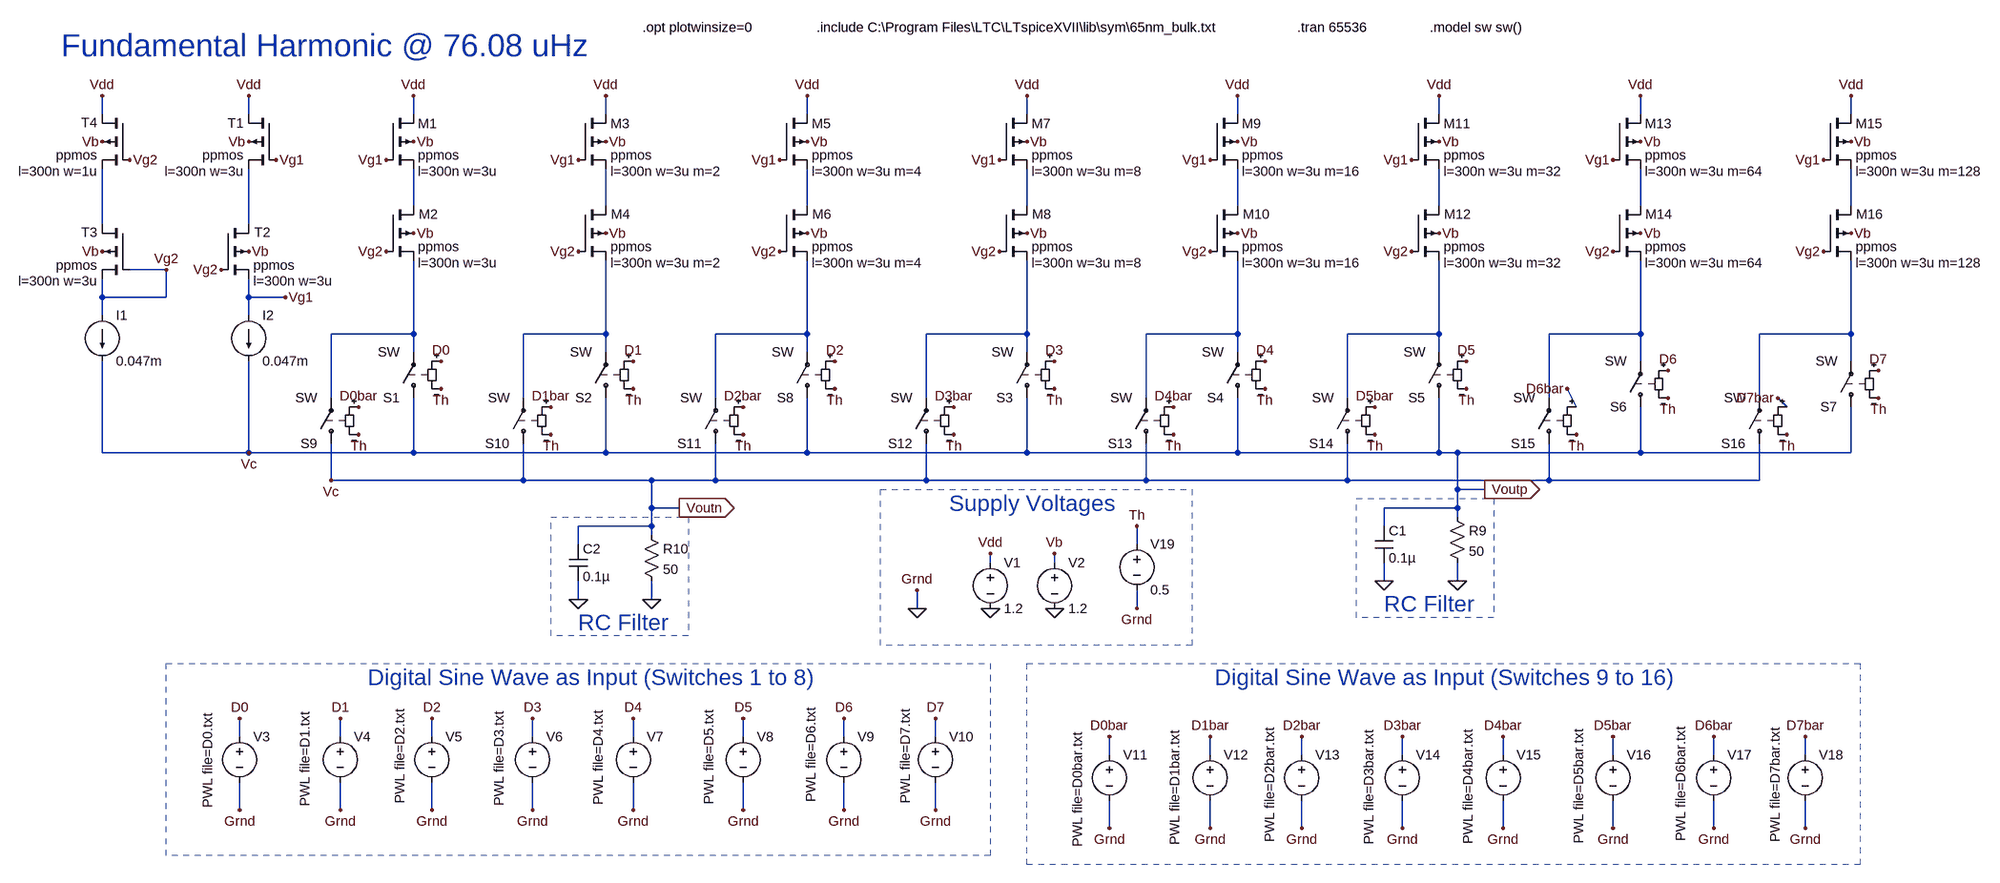
[diagram p0: schematic Sine Wave With Diff DAC.asc]
Sine Wave With Diff DAC.asc, the LTspice schematic file:
Version 4
SHEET 1 1928 980
WIRE -1504 -640 -1504 -672
WIRE -1248 -640 -1248 -672
WIRE -960 -640 -960 -672
WIRE -624 -640 -624 -672
WIRE -272 -640 -272 -672
WIRE 112 -640 112 -672
WIRE 480 -640 480 -672
WIRE 832 -640 832 -672
WIRE 1184 -640 1184 -672
WIRE 1552 -640 1552 -672
WIRE -960 -480 -960 -544
WIRE -624 -480 -624 -544
WIRE -272 -480 -272 -544
WIRE 112 -480 112 -544
WIRE 480 -480 480 -544
WIRE 832 -480 832 -544
WIRE 1184 -480 1184 -544
WIRE 1552 -480 1552 -544
WIRE -1504 -448 -1504 -544
WIRE -1248 -448 -1248 -544
WIRE -1392 -368 -1456 -368
WIRE -1504 -320 -1504 -352
WIRE -1392 -320 -1392 -368
WIRE -1392 -320 -1504 -320
WIRE -1248 -320 -1248 -352
WIRE -1184 -320 -1248 -320
WIRE -1504 -288 -1504 -320
WIRE -1248 -288 -1248 -320
WIRE -960 -256 -960 -384
WIRE -960 -256 -1104 -256
WIRE -624 -256 -624 -384
WIRE -624 -256 -768 -256
WIRE -272 -256 -272 -384
WIRE -272 -256 -432 -256
WIRE 112 -256 112 -384
WIRE 112 -256 -64 -256
WIRE 480 -256 480 -384
WIRE 480 -256 320 -256
WIRE 832 -256 832 -384
WIRE 832 -256 672 -256
WIRE 1184 -256 1184 -384
WIRE 1184 -256 1024 -256
WIRE 1552 -256 1552 -384
WIRE 1552 -256 1392 -256
WIRE -960 -224 -960 -256
WIRE -624 -224 -624 -256
WIRE -272 -224 -272 -256
WIRE 112 -224 112 -256
WIRE 480 -224 480 -256
WIRE 832 -224 832 -256
WIRE 1184 -208 1184 -256
WIRE 1552 -208 1552 -256
WIRE -1104 -144 -1104 -256
WIRE -768 -144 -768 -256
WIRE -432 -144 -432 -256
WIRE -64 -144 -64 -256
WIRE 320 -144 320 -256
WIRE 672 -144 672 -256
WIRE 1024 -144 1024 -256
WIRE 1392 -144 1392 -256
WIRE 1072 -128 1056 -160
WIRE 1440 -128 1424 -144
WIRE -1504 -48 -1504 -208
WIRE -1248 -48 -1248 -208
WIRE -1248 -48 -1504 -48
WIRE -960 -48 -960 -144
WIRE -960 -48 -1248 -48
WIRE -624 -48 -624 -144
WIRE -624 -48 -960 -48
WIRE -272 -48 -272 -144
WIRE -272 -48 -624 -48
WIRE 112 -48 112 -144
WIRE 112 -48 -272 -48
WIRE 480 -48 480 -144
WIRE 480 -48 112 -48
WIRE 832 -48 832 -144
WIRE 832 -48 480 -48
WIRE 864 -48 832 -48
WIRE 1184 -48 1184 -128
WIRE 1184 -48 864 -48
WIRE 1552 -48 1552 -128
WIRE 1552 -48 1184 -48
WIRE -1104 0 -1104 -64
WIRE -768 0 -768 -64
WIRE -768 0 -1104 0
WIRE -544 0 -768 0
WIRE -432 0 -432 -64
WIRE -432 0 -544 0
WIRE -64 0 -64 -64
WIRE -64 0 -432 0
WIRE 320 0 320 -64
WIRE 320 0 -64 0
WIRE 672 0 672 -64
WIRE 672 0 320 0
WIRE 1024 0 1024 -64
WIRE 1024 0 672 0
WIRE 1392 0 1392 -64
WIRE 1392 0 1024 0
WIRE 864 16 864 -48
WIRE 912 16 864 16
WIRE -544 48 -544 0
WIRE -496 48 -544 48
WIRE 864 48 864 16
WIRE 864 48 736 48
WIRE 864 64 864 48
WIRE -544 80 -544 48
WIRE -544 80 -672 80
WIRE 736 80 736 48
WIRE -544 96 -544 80
WIRE -672 112 -672 80
WIRE 304 112 304 80
WIRE 48 144 48 128
WIRE 160 144 160 128
WIRE 736 176 736 144
WIRE 864 176 864 144
WIRE -672 208 -672 176
WIRE -544 208 -544 176
WIRE -80 224 -80 192
WIRE 304 224 304 192
WIRE -1264 448 -1264 416
WIRE -1088 448 -1088 416
WIRE -928 448 -928 416
WIRE -752 448 -752 416
WIRE -576 448 -576 416
WIRE -384 448 -384 416
WIRE -208 448 -208 416
WIRE -48 448 -48 416
WIRE 256 480 256 448
WIRE 432 480 432 448
WIRE 592 480 592 448
WIRE 768 480 768 448
WIRE 944 480 944 448
WIRE 1136 480 1136 448
WIRE 1312 480 1312 448
WIRE 1472 480 1472 448
WIRE -1264 576 -1264 528
WIRE -1088 576 -1088 528
WIRE -928 576 -928 528
WIRE -752 576 -752 528
WIRE -576 576 -576 528
WIRE -384 576 -384 528
WIRE -208 576 -208 528
WIRE -48 576 -48 528
WIRE 256 608 256 560
WIRE 432 608 432 560
WIRE 592 608 592 560
WIRE 768 608 768 560
WIRE 944 608 944 560
WIRE 1136 608 1136 560
WIRE 1312 608 1312 560
WIRE 1472 608 1472 560
FLAG -1504 -400 Vb
FLAG -1248 -400 Vb
FLAG -1504 -592 Vb
FLAG -1248 -592 Vb
FLAG -1248 -672 Vdd
FLAG -1504 -672 Vdd
FLAG -1456 -560 Vg2
FLAG -1392 -368 Vg2
FLAG -1200 -560 Vg1
FLAG -1184 -320 Vg1
FLAG -960 -432 Vb
FLAG -960 -592 Vb
FLAG -960 -672 Vdd
FLAG -1008 -560 Vg1
FLAG -1008 -400 Vg2
FLAG -1296 -368 Vg2
FLAG -624 -432 Vb
FLAG -624 -592 Vb
FLAG -624 -672 Vdd
FLAG -672 -560 Vg1
FLAG -672 -400 Vg2
FLAG -272 -432 Vb
FLAG -272 -592 Vb
FLAG -272 -672 Vdd
FLAG -320 -560 Vg1
FLAG -320 -400 Vg2
FLAG 112 -432 Vb
FLAG 112 -592 Vb
FLAG 112 -672 Vdd
FLAG 64 -560 Vg1
FLAG 64 -400 Vg2
FLAG 480 -432 Vb
FLAG 480 -592 Vb
FLAG 480 -672 Vdd
FLAG 432 -560 Vg1
FLAG 432 -400 Vg2
FLAG 832 -432 Vb
FLAG 832 -592 Vb
FLAG 832 -672 Vdd
FLAG 784 -560 Vg1
FLAG 784 -400 Vg2
FLAG 1184 -432 Vb
FLAG 1184 -592 Vb
FLAG 1184 -672 Vdd
FLAG 1136 -560 Vg1
FLAG 1136 -400 Vg2
FLAG 1552 -432 Vb
FLAG 1552 -592 Vb
FLAG 1552 -672 Vdd
FLAG 1504 -560 Vg1
FLAG 1504 -400 Vg2
FLAG 160 128 Vb
FLAG 48 128 Vdd
FLAG -912 -160 Th
FLAG -576 -160 Th
FLAG -224 -160 Th
FLAG 160 -160 Th
FLAG 528 -160 Th
FLAG 880 -160 Th
FLAG 1232 -144 Th
FLAG 1600 -144 Th
FLAG -912 -208 D0
FLAG -576 -208 D1
FLAG -224 -208 D2
FLAG 160 -208 D3
FLAG 528 -208 D4
FLAG 880 -208 D5
FLAG 1232 -192 D6
FLAG 1600 -192 D7
FLAG 912 16 Voutp
IOPIN 912 16 Out
FLAG 864 176 0
FLAG 48 224 0
FLAG 160 224 0
FLAG -80 224 0
FLAG -80 192 Grnd
FLAG 736 176 0
FLAG -1248 -48 Vc
FLAG -496 48 Voutn
IOPIN -496 48 Out
FLAG -544 208 0
FLAG -672 208 0
FLAG -1056 -80 Th
FLAG -720 -80 Th
FLAG -384 -80 Th
FLAG -16 -80 Th
FLAG 368 -80 Th
FLAG 720 -80 Th
FLAG 1072 -80 Th
FLAG 1440 -80 Th
FLAG -1056 -128 D0bar
FLAG -720 -128 D1bar
FLAG -384 -128 D2bar
FLAG -16 -128 D3bar
FLAG 368 -128 D4bar
FLAG 720 -128 D5bar
FLAG 1056 -160 D6bar
FLAG 1424 -144 D7bar
FLAG -1104 0 Vc
FLAG -1088 576 Grnd
FLAG -928 576 Grnd
FLAG -752 576 Grnd
FLAG -576 576 Grnd
FLAG -384 576 Grnd
FLAG -208 576 Grnd
FLAG -48 576 Grnd
FLAG -1264 576 Grnd
FLAG -1264 416 D0
FLAG -1088 416 D1
FLAG -928 416 D2
FLAG -752 416 D3
FLAG -576 416 D4
FLAG -384 416 D5
FLAG -208 416 D6
FLAG -48 416 D7
FLAG 432 608 Grnd
FLAG 592 608 Grnd
FLAG 768 608 Grnd
FLAG 944 608 Grnd
FLAG 1136 608 Grnd
FLAG 1312 608 Grnd
FLAG 1472 608 Grnd
FLAG 256 608 Grnd
FLAG 256 448 D0bar
FLAG 432 448 D1bar
FLAG 592 448 D2bar
FLAG 768 448 D3bar
FLAG 944 448 D4bar
FLAG 1136 448 D5bar
FLAG 1312 448 D6bar
FLAG 1472 448 D7bar
FLAG 304 224 Grnd
FLAG 304 80 Th
SYMBOL pmos4 -1200 -640 M0
WINDOW 0 56 16 Left 2
WINDOW 123 56 100 Left 2
SYMATTR InstName T1
SYMATTR Value2 l=300n w=3u
SYMATTR Value ppmos
SYMBOL pmos4 -1296 -448 R0
WINDOW 0 58 15 Left 2
WINDOW 123 56 100 Left 2
SYMATTR InstName T2
SYMATTR Value2 l=300n w=3u
SYMATTR Value ppmos
SYMBOL pmos4 -1456 -448 M0
WINDOW 0 56 15 Left 2
WINDOW 123 56 100 Left 2
SYMATTR InstName T3
SYMATTR Value2 l=300n w=3u
SYMATTR Value ppmos
SYMBOL current -1504 -288 R0
WINDOW 123 0 0 Left 0
WINDOW 39 0 0 Left 0
SYMATTR InstName I1
SYMATTR Value 0.047m
SYMBOL current -1248 -288 R0
WINDOW 123 0 0 Left 0
WINDOW 39 0 0 Left 0
SYMATTR InstName I2
SYMATTR Value 0.047m
SYMBOL pmos4 -1456 -640 M0
WINDOW 0 56 15 Left 2
WINDOW 123 56 100 Left 2
SYMATTR InstName T4
SYMATTR Value2 l=300n w=1u
SYMATTR Value ppmos
SYMBOL pmos4 -1008 -640 R0
WINDOW 0 56 17 Left 2
WINDOW 123 56 100 Left 2
SYMATTR InstName M1
SYMATTR Value2 l=300n w=3u
SYMATTR Value ppmos
SYMBOL pmos4 -1008 -480 R0
WINDOW 0 57 15 Left 2
WINDOW 123 56 100 Left 2
SYMATTR InstName M2
SYMATTR Value2 l=300n w=3u
SYMATTR Value ppmos
SYMBOL pmos4 -672 -640 R0
WINDOW 0 56 17 Left 2
WINDOW 123 56 100 Left 2
SYMATTR InstName M3
SYMATTR Value2 l=300n w=3u m=2
SYMATTR Value ppmos
SYMBOL pmos4 -672 -480 R0
WINDOW 0 57 15 Left 2
WINDOW 123 56 100 Left 2
SYMATTR InstName M4
SYMATTR Value2 l=300n w=3u m=2
SYMATTR Value ppmos
SYMBOL pmos4 -320 -640 R0
WINDOW 0 56 17 Left 2
WINDOW 123 56 100 Left 2
SYMATTR InstName M5
SYMATTR Value2 l=300n w=3u m=4
SYMATTR Value ppmos
SYMBOL pmos4 -320 -480 R0
WINDOW 0 57 15 Left 2
WINDOW 123 56 100 Left 2
SYMATTR InstName M6
SYMATTR Value2 l=300n w=3u m=4
SYMATTR Value ppmos
SYMBOL pmos4 64 -640 R0
WINDOW 0 56 17 Left 2
WINDOW 123 56 100 Left 2
SYMATTR InstName M7
SYMATTR Value2 l=300n w=3u m=8
SYMATTR Value ppmos
SYMBOL pmos4 64 -480 R0
WINDOW 0 57 15 Left 2
WINDOW 123 56 100 Left 2
SYMATTR InstName M8
SYMATTR Value2 l=300n w=3u m=8
SYMATTR Value ppmos
SYMBOL pmos4 432 -640 R0
WINDOW 0 56 17 Left 2
WINDOW 123 56 100 Left 2
SYMATTR InstName M9
SYMATTR Value2 l=300n w=3u m=16
SYMATTR Value ppmos
SYMBOL pmos4 432 -480 R0
WINDOW 0 57 15 Left 2
WINDOW 123 56 100 Left 2
SYMATTR InstName M10
SYMATTR Value2 l=300n w=3u m=16
SYMATTR Value ppmos
SYMBOL pmos4 784 -640 R0
WINDOW 0 56 17 Left 2
WINDOW 123 56 100 Left 2
SYMATTR InstName M11
SYMATTR Value2 l=300n w=3u m=32
SYMATTR Value ppmos
SYMBOL pmos4 784 -480 R0
WINDOW 0 57 15 Left 2
WINDOW 123 56 100 Left 2
SYMATTR InstName M12
SYMATTR Value2 l=300n w=3u m=32
SYMATTR Value ppmos
SYMBOL pmos4 1136 -640 R0
WINDOW 0 56 17 Left 2
WINDOW 123 56 100 Left 2
SYMATTR InstName M13
SYMATTR Value2 l=300n w=3u m=64
SYMATTR Value ppmos
SYMBOL pmos4 1136 -480 R0
WINDOW 0 57 15 Left 2
WINDOW 123 56 100 Left 2
SYMATTR InstName M14
SYMATTR Value2 l=300n w=3u m=64
SYMATTR Value ppmos
SYMBOL pmos4 1504 -640 R0
WINDOW 0 56 17 Left 2
WINDOW 123 56 100 Left 2
SYMATTR InstName M15
SYMATTR Value2 l=300n w=3u m=128
SYMATTR Value ppmos
SYMBOL pmos4 1504 -480 R0
WINDOW 0 57 15 Left 2
WINDOW 123 56 100 Left 2
SYMATTR InstName M16
SYMATTR Value2 l=300n w=3u m=128
SYMATTR Value ppmos
SYMBOL voltage 48 128 R0
WINDOW 123 0 0 Left 0
WINDOW 39 0 0 Left 0
SYMATTR InstName V1
SYMATTR Value 1.2
SYMBOL voltage 160 128 R0
WINDOW 123 0 0 Left 0
WINDOW 39 0 0 Left 0
SYMATTR InstName V2
SYMATTR Value 1.2
SYMBOL sw -960 -128 R180
SYMATTR InstName S1
SYMBOL sw -624 -128 R180
SYMATTR InstName S2
SYMBOL sw 112 -128 R180
SYMATTR InstName S3
SYMBOL sw 480 -128 R180
SYMATTR InstName S4
SYMBOL sw 832 -128 R180
SYMATTR InstName S5
SYMBOL sw 1184 -112 R180
SYMATTR InstName S6
SYMBOL sw 1552 -112 R180
SYMATTR InstName S7
SYMBOL sw -272 -128 R180
SYMATTR InstName S8
SYMBOL res 848 48 R0
SYMATTR InstName R9
SYMATTR Value 50
SYMBOL cap 720 80 R0
SYMATTR InstName C1
SYMATTR Value 0.1µ
SYMBOL sw -1104 -48 R180
SYMATTR InstName S9
SYMBOL sw -768 -48 R180
SYMATTR InstName S10
SYMBOL sw -432 -48 R180
SYMATTR InstName S11
SYMBOL sw -64 -48 R180
SYMATTR InstName S12
SYMBOL sw 320 -48 R180
SYMATTR InstName S13
SYMBOL sw 672 -48 R180
SYMATTR InstName S14
SYMBOL sw 1024 -48 R180
SYMATTR InstName S15
SYMBOL sw 1392 -48 R180
SYMATTR InstName S16
SYMBOL res -560 80 R0
SYMATTR InstName R10
SYMATTR Value 50
SYMBOL cap -688 112 R0
SYMATTR InstName C2
SYMATTR Value 0.1µ
SYMBOL voltage -1264 432 R0
WINDOW 3 -55 -25 VRight 2
WINDOW 123 0 0 Left 0
WINDOW 39 0 0 Left 0
SYMATTR Value PWL file=D0.txt
SYMATTR InstName V3
SYMBOL voltage -1088 432 R0
WINDOW 3 -61 -28 VRight 2
WINDOW 123 0 0 Left 0
WINDOW 39 0 0 Left 0
SYMATTR Value PWL file=D1.txt
SYMATTR InstName V4
SYMBOL voltage -928 432 R0
WINDOW 3 -55 -33 VRight 2
WINDOW 123 0 0 Left 0
WINDOW 39 0 0 Left 0
SYMATTR Value PWL file=D2.txt
SYMATTR InstName V5
SYMBOL voltage -752 432 R0
WINDOW 3 -58 -29 VRight 2
WINDOW 123 0 0 Left 0
WINDOW 39 0 0 Left 0
SYMATTR Value PWL file=D3.txt
SYMATTR InstName V6
SYMBOL voltage -576 432 R0
WINDOW 3 -61 -30 VRight 2
WINDOW 123 0 0 Left 0
WINDOW 39 0 0 Left 0
SYMATTR Value PWL file=D4.txt
SYMATTR InstName V7
SYMBOL voltage -384 432 R0
WINDOW 3 -59 -31 VRight 2
WINDOW 123 0 0 Left 0
WINDOW 39 0 0 Left 0
SYMATTR Value PWL file=D5.txt
SYMATTR InstName V8
SYMBOL voltage -208 432 R0
WINDOW 3 -57 -35 VRight 2
WINDOW 123 0 0 Left 0
WINDOW 39 0 0 Left 0
SYMATTR Value PWL file=D6.txt
SYMATTR InstName V9
SYMBOL voltage -48 432 R0
WINDOW 3 -52 -33 VRight 2
WINDOW 123 0 0 Left 0
WINDOW 39 0 0 Left 0
SYMATTR Value PWL file=D7.txt
SYMATTR InstName V10
SYMBOL voltage 256 464 R0
WINDOW 3 -55 -25 VRight 2
WINDOW 123 0 0 Left 0
WINDOW 39 0 0 Left 0
SYMATTR Value PWL file=D0bar.txt
SYMATTR InstName V11
SYMBOL voltage 432 464 R0
WINDOW 3 -61 -28 VRight 2
WINDOW 123 0 0 Left 0
WINDOW 39 0 0 Left 0
SYMATTR Value PWL file=D1bar.txt
SYMATTR InstName V12
SYMBOL voltage 592 464 R0
WINDOW 3 -55 -33 VRight 2
WINDOW 123 0 0 Left 0
WINDOW 39 0 0 Left 0
SYMATTR Value PWL file=D2bar.txt
SYMATTR InstName V13
SYMBOL voltage 768 464 R0
WINDOW 3 -58 -29 VRight 2
WINDOW 123 0 0 Left 0
WINDOW 39 0 0 Left 0
SYMATTR Value PWL file=D3bar.txt
SYMATTR InstName V14
SYMBOL voltage 944 464 R0
WINDOW 3 -61 -30 VRight 2
WINDOW 123 0 0 Left 0
WINDOW 39 0 0 Left 0
SYMATTR Value PWL file=D4bar.txt
SYMATTR InstName V15
SYMBOL voltage 1136 464 R0
WINDOW 3 -59 -31 VRight 2
WINDOW 123 0 0 Left 0
WINDOW 39 0 0 Left 0
SYMATTR Value PWL file=D5bar.txt
SYMATTR InstName V16
SYMBOL voltage 1312 464 R0
WINDOW 3 -57 -35 VRight 2
WINDOW 123 0 0 Left 0
WINDOW 39 0 0 Left 0
SYMATTR Value PWL file=D6bar.txt
SYMATTR InstName V17
SYMBOL voltage 1472 464 R0
WINDOW 3 -52 -33 VRight 2
WINDOW 123 0 0 Left 0
WINDOW 39 0 0 Left 0
SYMATTR Value PWL file=D7bar.txt
SYMATTR InstName V18
SYMBOL voltage 304 96 R0
WINDOW 123 0 0 Left 0
WINDOW 39 0 0 Left 0
SYMATTR InstName V19
SYMATTR Value 0.5
TEXT -256 -792 Left 2 !.include C:\\Program Files\\LTC\\LTspiceXVII\\lib\\sym\\65nm_bulk.txt
TEXT -560 -792 Left 2 !.opt plotwinsize=0
TEXT 816 -792 Left 2 !.model sw sw()
TEXT 584 -792 Left 2 !.tran 65536
TEXT 736 216 Left 4 ;RC Filter
TEXT -672 248 Left 4 ;RC Filter
TEXT -24 40 Left 4 ;Supply Voltages
TEXT -1040 344 Left 4 ;Digital Sine Wave as Input (Switches 1 to 8)
TEXT 440 344 Left 4 ;Digital Sine Wave as Input (Switches 9 to 16)
TEXT -1576 -760 Left 5 ;Fundamental Harmonic @ 76.08 uHz
RECTANGLE Normal 928 240 688 32 2
RECTANGLE Normal 400 288 -144 16 2
RECTANGLE Normal 48 656 -1392 320 2
RECTANGLE Normal 1568 672 112 320 2
RECTANGLE Normal -480 272 -720 64 2

The netlist it stands for:
* Sine Wave With Diff DAC.asc
M§T1 Vdd Vg1 N010 Vb ppmos l=300n w=3u
M§T2 N010 Vg2 Vg1 Vb ppmos l=300n w=3u
M§T3 N009 Vg2 Vg2 Vb ppmos l=300n w=3u
I1 Vg2 Voutn 0.047m
I2 Vg1 Voutn 0.047m
M§T4 Vdd Vg2 N009 Vb ppmos l=300n w=1u
M1 Vdd Vg1 N001 Vb ppmos l=300n w=3u
M2 N001 Vg2 N011 Vb ppmos l=300n w=3u
M3 Vdd Vg1 N002 Vb ppmos l=300n w=3u m=2
M4 N002 Vg2 N012 Vb ppmos l=300n w=3u m=2
M5 Vdd Vg1 N003 Vb ppmos l=300n w=3u m=4
M6 N003 Vg2 N013 Vb ppmos l=300n w=3u m=4
M7 Vdd Vg1 N004 Vb ppmos l=300n w=3u m=8
M8 N004 Vg2 N014 Vb ppmos l=300n w=3u m=8
M9 Vdd Vg1 N005 Vb ppmos l=300n w=3u m=16
M10 N005 Vg2 N015 Vb ppmos l=300n w=3u m=16
M11 Vdd Vg1 N006 Vb ppmos l=300n w=3u m=32
M12 N006 Vg2 N016 Vb ppmos l=300n w=3u m=32
M13 Vdd Vg1 N007 Vb ppmos l=300n w=3u m=64
M14 N007 Vg2 N017 Vb ppmos l=300n w=3u m=64
M15 Vdd Vg1 N008 Vb ppmos l=300n w=3u m=128
M16 N008 Vg2 N018 Vb ppmos l=300n w=3u m=128
V1 Vdd 0 1.2
V2 Vb 0 1.2
S1 Voutn N011 D0 Th SW
S2 Voutn N012 D1 Th SW
S3 Voutn N014 D3 Th SW
S4 Voutn N015 D4 Th SW
S5 Voutn N016 D5 Th SW
S6 Voutn N017 D6 Th SW
S7 Voutn N018 D7 Th SW
S8 Voutn N013 D2 Th SW
R9 Voutn 0 50
C1 Voutn 0 0.1µ
S9 Voutn N011 D0bar Th SW
S10 Voutn N012 D1bar Th SW
S11 Voutn N013 D2bar Th SW
S12 Voutn N014 D3bar Th SW
S13 Voutn N015 D4bar Th SW
S14 Voutn N016 D5bar Th SW
S15 Voutn N017 D6bar Th SW
S16 Voutn N018 D7bar Th SW
R10 Voutn 0 50
C2 Voutn 0 0.1µ
V3 D0 0 PWL file=D0.txt
V4 D1 0 PWL file=D1.txt
V5 D2 0 PWL file=D2.txt
V6 D3 0 PWL file=D3.txt
V7 D4 0 PWL file=D4.txt
V8 D5 0 PWL file=D5.txt
V9 D6 0 PWL file=D6.txt
V10 D7 0 PWL file=D7.txt
V11 D0bar 0 PWL file=D0bar.txt
V12 D1bar 0 PWL file=D1bar.txt
V13 D2bar 0 PWL file=D2bar.txt
V14 D3bar 0 PWL file=D3bar.txt
V15 D4bar 0 PWL file=D4bar.txt
V16 D5bar 0 PWL file=D5bar.txt
V17 D6bar 0 PWL file=D6bar.txt
V18 D7bar 0 PWL file=D7bar.txt
V19 Th 0 0.5
.model NMOS NMOS
.model PMOS PMOS
.lib standard.mos
.include C:\Program Files\LTC\LTspiceXVII\lib\sym\65nm_bulk.txt
.opt plotwinsize=0
.model sw sw()
.tran 65536
* RC Filter
* RC Filter
* Supply Voltages
* Digital Sine Wave as Input (Switches 1 to 8)
* Digital Sine Wave as Input (Switches 9 to 16)
* Fundamental Harmonic @ 76.08 uHz
.backanno
.end